# Altium project nrf52833_qiaa_var5.PrjPCB
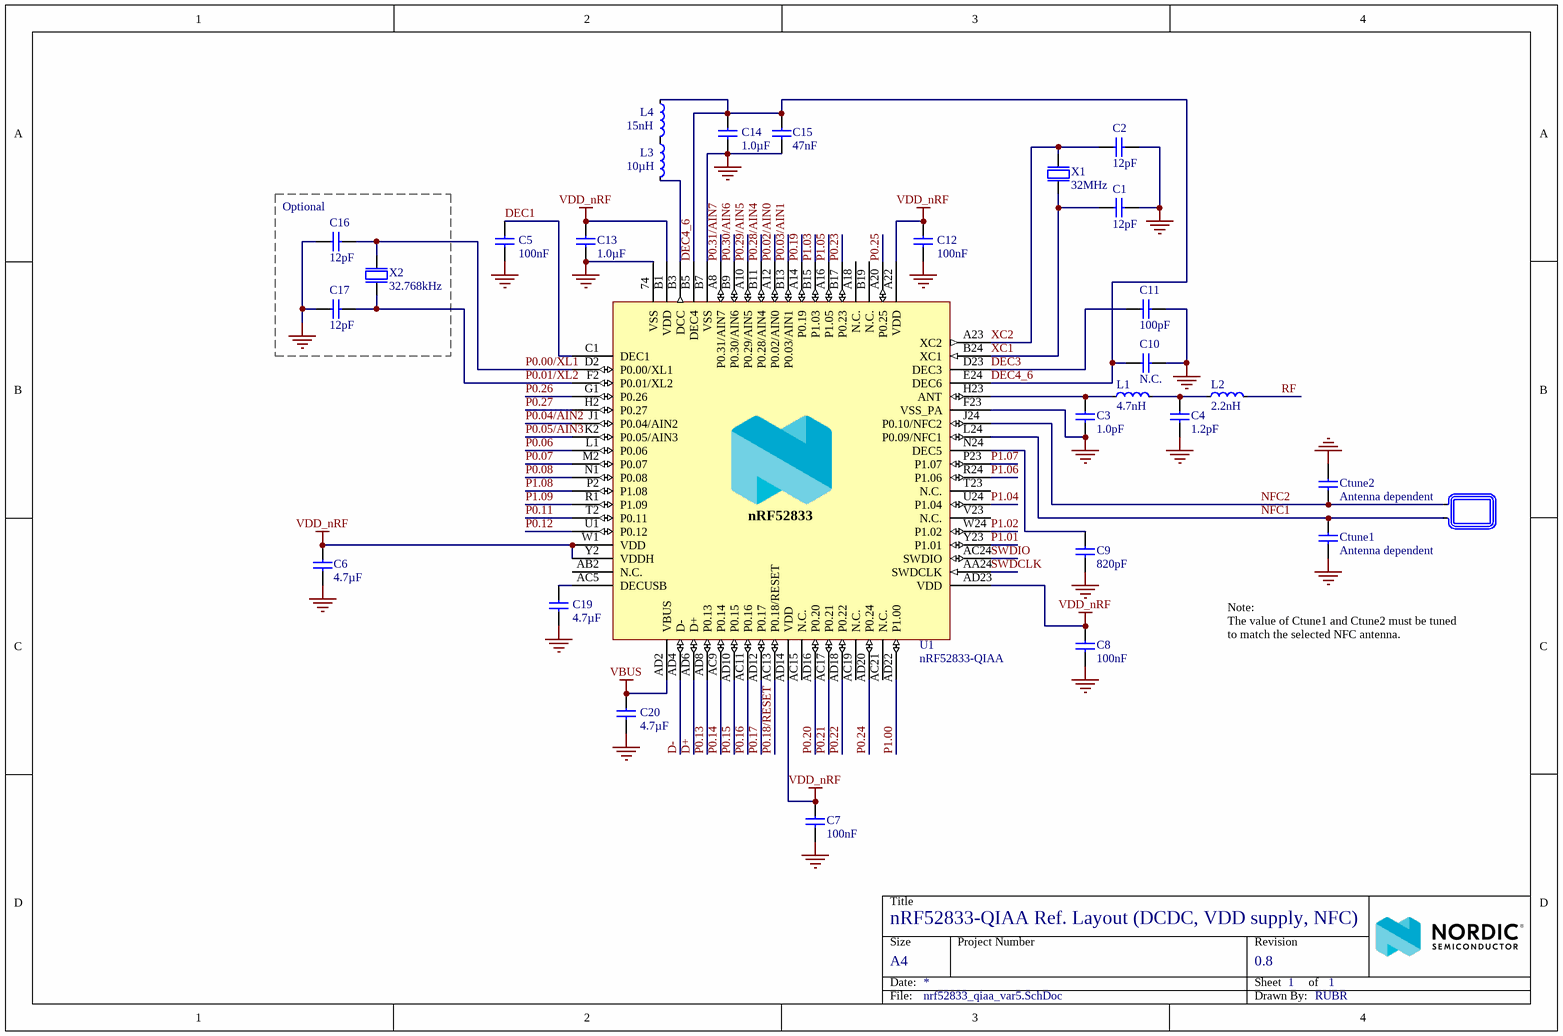
[diagram p0: nrf52833_qiaa_var5.SchDoc]
1 sheet, 29 parts. Net scope: global (net labels, ports and power ports of the same name join across sheets).
Board file: nrf52833_qiaa_var5.PcbDoc

## Sheet nrf52833_qiaa_var5.SchDoc: nRF52833-QIAA Ref. Layout (DCDC, VDD supply, NFC)
size A4; Revision: 0.8; SheetNumber: 1; SheetTotal: 1; DrawnBy: RUBR; DocumentSize: A4; PCAName: nRF52833-QIAA Ref. Layout (DCDC, VDD supply, NFC)

### Parts
A1  NFC Antenna  [TP_2x1mm_TH]  (value not drawn)  (no BOM)
C1  12pF  [CAPC1005X04L]
C2  12pF  [CAPC1005X04L]
C3  1.0pF  [CAPC1005X04L]
C4  1.2pF  [CAPC1005X04L]
C5  100nF  [CAPC1005X04L]
C6  4.7µF  [CAPC1608X06L]
C7  100nF  [CAPC1005X04L]
C8  100nF  [CAPC1005X04L]
C9  820pF  [CAPC1005X04L]
C10  N.C.  [CAPC1005X04L]
C11  100pF  [CAPC1005X04L]
C12  100nF  [CAPC1005X04L]
C13  1.0µF  [CAPC1608X06L]
C14  1.0µF  [CAPC1608X06L]
C15  47nF  [CAPC1005X04L]
C16  12pF  [CAPC1005X04L]
C17  12pF  [CAPC1005X04L]
C19  4.7µF  [CAPC1608X06L]
C20  4.7µF  [CAPC1608X06L]
Ctune1  Antenna dependent  [CAPC1005X04L]
Ctune2  Antenna dependent  [CAPC1005X04L]
L1  4.7nH  [INDC1005X04L]
L2  2.2nH  [INDC1005X04L]
L3  10µH  [INDC1608X06L]
L4  15nH  [INDC1005X04L]
U1  nRF52833-QIAA  [AQFN50P700X700X85_HS-74N]
X1  32MHz  [BT-XTAL_2016]
X2  32.768kHz  [XTAL_3215]

### Blocks framed on the sheet
Optional: C16 C17 X2

### Nets
GND: C1.2 C2.2 C3.1 C4.1 C5.2 C6.2 C7.2 C8.2 C9.2 C10.1 C11.2 C12.2 C13.2 C14.1 C15.2 C16.2 C17.2 C19.2 C20.2 Ctune1.2 Ctune2.1 U1.74(VSS) U1.B7(VSS) U1.F23(VSS_PA) X1.2(GND) X1.4(GND)
VBUS: C20.1 U1.AD2(VBUS)
VDD_nRF: C6.1 C7.1 C8.1 C12.1 C13.1 U1.A22(VDD) U1.AD14(VDD) U1.AD23(VDD) U1.B1(VDD) U1.W1(VDD) U1.Y2(VDDH)
D+: U1.AD6(D+)
D-: U1.AD4(D-)
DEC1: C5.1 U1.C1(DEC1)
DEC3: C11.1 U1.D23(DEC3)
DEC4_6: C10.2 C14.2 C15.1 L4.1 U1.B5(DEC4) U1.E24(DEC6)
NFC1: A1.2 Ctune1.1 U1.L24(P0.09/NFC1)
NFC2: A1.1 Ctune2.2 U1.J24(P0.10/NFC2)
P0.00/XL1: C16.1 U1.D2(P0.00/XL1) X2.1(inp)
P0.01/XL2: C17.1 U1.F2(P0.01/XL2) X2.2(out)
P0.02/AIN0: U1.A12(P0.02/AIN0)
P0.03/AIN1: U1.B13(P0.03/AIN1)
P0.04/AIN2: U1.J1(P0.04/AIN2)
P0.05/AIN3: U1.K2(P0.05/AIN3)
P0.06: U1.L1(P0.06)
P0.07: U1.M2(P0.07)
P0.08: U1.N1(P0.08)
P0.11: U1.T2(P0.11)
P0.12: U1.U1(P0.12)
P0.13: U1.AD8(P0.13)
P0.14: U1.AC9(P0.14)
P0.15: U1.AD10(P0.15)
P0.16: U1.AC11(P0.16)
P0.17: U1.AD12(P0.17)
P0.18/RESET: U1.AC13(P0.18/RESET)
P0.19: U1.A14(P0.19)
P0.20: U1.AD16(P0.20)
P0.21: U1.AC17(P0.21)
P0.22: U1.AD18(P0.22)
P0.23: U1.B17(P0.23)
P0.24: U1.AD20(P0.24)
P0.25: U1.A20(P0.25)
P0.26: U1.G1(P0.26)
P0.27: U1.H2(P0.27)
P0.28/AIN4: U1.B11(P0.28/AIN4)
P0.29/AIN5: U1.A10(P0.29/AIN5)
P0.30/AIN6: U1.B9(P0.30/AIN6)
P0.31/AIN7: U1.A8(P0.31/AIN7)
P1.00: U1.AD22(P1.00)
P1.01: U1.Y23(P1.01)
P1.02: U1.W24(P1.02)
P1.03: U1.B15(P1.03)
P1.04: U1.U24(P1.04)
P1.05: U1.A16(P1.05)
P1.06: U1.R24(P1.06)
P1.07: U1.P23(P1.07)
P1.08: U1.P2(P1.08)
P1.09: U1.R1(P1.09)
RF: L2.2
SWDCLK: U1.AA24(SWDCLK)
SWDIO: U1.AC24(SWDIO)
XC1: C1.1 U1.B24(XC1) X1.1(inp)
XC2: C2.1 U1.A23(XC2) X1.3(out)
NetC3_2: C3.2 L1.1 U1.H23(ANT)
NetC4_2: C4.2 L1.2 L2.1
NetC9_1: C9.1 U1.N24(DEC5)
NetC19_1: C19.1 U1.AC5(DECUSB)
NetL3_1: L3.1 L4.2
NetL3_2: L3.2 U1.B3(DCC)

Not connected (* = marked no-connect by the designer): U1 A18(N.C.) AB2(N.C.) AC15(N.C.) AC19(N.C.) AC21(N.C.) B19(N.C.) T23(N.C.) V23(N.C.)

### Notes on the sheet
- Note:
  The value of Ctune1 and Ctune2 must be tuned to match the selected NFC antenna.
- Title
- Size
- Date:
- A4
- Project Number
- Sheet         of
- Revision
- File:
- Drawn By:
- (in symbol nRF52833-QIAA) nRF52833

### Library data of the parts
A1 = NFC_ANT_TP: Part Number: NFC_ANT_TP; Footprint Doc: TP_2x1mm_TH; LatestRevisionDate: 2016-02-23; Pin Count: 2; Publisher: Nordic Semiconductor; Published: 2016-02-23; Value: NFC Antenna; Note: *
C1 C2 C16 C17 = C0402-12p: Capacitor, NP0, ±2%; Note: 50V; Part Number: C0402-12p; LatestRevisionDate: 2011-05-11; Pin Count: 2; Publisher: Nordic Semiconductor; Published: 2009-05-08; Value: 12pF; Footprint Doc: 0402
C3 = C0402-1.0p: Capacitor, NP0, ±5%; Note: 50V; Part Number: C0402-1.0p; LatestRevisionDate: 2017-02-23; Pin Count: 2; Publisher: Nordic Semiconductor; Published: 2009-05-08; Value: 1.0pF; Footprint Doc: 0402
C4 = C0402-1.2p: Capacitor, NP0, ±5%; Note: 50V; Part Number: C0402-1.2p; LatestRevisionDate: 2011-05-11; Pin Count: 2; Publisher: Nordic Semiconductor; Published: 2009-05-08; Value: 1.2pF; Footprint Doc: 0402
C5 C7 C8 C12 = C0402-100n: Capacitor, X7R, ±10%; Note: 16V; Part Number: C0402-100n; LatestRevisionDate: 2009-11-23; Pin Count: 2; Publisher: Nordic Semiconductor; Published: 2009-05-08; Value: 100nF; Footprint Doc: 0402
C6 C19 = C0603-4µ7-6.3V-X7R: Capacitor, X7R, ±10%; Note: 6.3V; Part Number: C0603-4µ7-6.3V-X7R; LatestRevisionDate: 2015-06-10; Pin Count: 2; Publisher: Nordic Semiconductor; Published: 2015-06-10; Value: 4.7µF; Footprint Doc: 0603
C9 = C0402-820p: Capacitor, NP0, ±5%; Note: 50V; Part Number: C0402-820p; LatestRevisionDate: 2009-05-08; Pin Count: 2; Publisher: Nordic Semiconductor; Published: 2009-05-08; Value: 820pF; Footprint Doc: 0402
C10 = C0402-N.C.: Not mounted; Assembly: Not mounted; Part Number: C0402-N.C.; LatestRevisionDate: 2009-05-08; Pin Count: 2; Publisher: Nordic Semiconductor; Published: 2009-05-08; Value: N.C.; Footprint Doc: 0402
C11 = C0402-100p: Capacitor, NP0, ±5%; Note: 50V; Part Number: C0402-100p; LatestRevisionDate: 2009-05-08; Pin Count: 2; Publisher: Nordic Semiconductor; Published: 2009-05-08; Value: 100pF; Footprint Doc: 0402
C13 C14 = C0603-1µ0: Capacitor, X7R, ±10%; Note: 16V; Part Number: C0603-1µ0; LatestRevisionDate: 2013-06-05; Pin Count: 2; Publisher: Nordic Semiconductor; Published: 2009-05-08; Value: 1.0µF; Footprint Doc: 0603
C15 = C0402-47n: Capacitor, X7R, ±10%; Note: Chip Cap 10%; Part Number: C0402-47n; LatestRevisionDate: 2009-05-08; Pin Count: 2; Publisher: Nordic Semiconductor; Published: 2009-05-08; Value: 47nF; Footprint Doc: 0402
C20 = C0603-4µ7-10V-X7S: Capacitor, X7S, ±10%; Note: 10V; Part Number: C0603-4µ7-10V-X7S; LatestRevisionDate: 2016-08-15; Pin Count: 2; Publisher: Nordic Semiconductor; Published: 2016-08-15; Value: 4.7µF; Footprint Doc: 0603
Ctune1 Ctune2 = C0402-TBD: Capacitor, NP0, ±5%; Note: 50V; Part Number: C0402-TBD; Footprint Doc: 0402; LatestRevisionDate: 2010-12-21; Pin Count: 2; Publisher: Nordic Semiconductor; Published: 2010-12-21; Value: Antenna dependent
L1 = L0402-4n7: High frequency chip inductor ±5%; Part Number: L0402-4n7; LatestRevisionDate: 2012-09-19; Pin Count: 2; Publisher: Nordic Semiconductor; Published: 2009-05-08; Value: 4.7nH; Note: High frequency chip inductor ±5%; Footprint Doc: 0402
L2 = L0402-2n2: High frequency chip inductor ±5%; Part Number: L0402-2n2; LatestRevisionDate: 2012-09-19; Pin Count: 2; Publisher: Nordic Semiconductor; Published: 2009-05-08; Value: 2.2nH; Note: High frequency chip inductor ±5%; Footprint Doc: 0402
L3 = L0603-10µ: Chip inductor, IDC,min = 50 mA, ±20%; Part Number: L0603-10µ; LatestRevisionDate: 2012-09-19; Pin Count: 2; Publisher: Nordic Semiconductor; Published: 2010-02-24; Value: 10µH; Footprint Doc: 0603
L4 = L0402-15n: High frequency chip inductor ±10%; Part Number: L0402-15n; LatestRevisionDate: 2012-09-19; Pin Count: 2; Publisher: Nordic Semiconductor; Published: 2010-07-12; Value: 15nH; Footprint Doc: 0402
U1 = nRF52833-QIAA: Multi-protocol Bluetooth Low Energy, IEEE 802.15.4, ANT and 2.4GHz proprietary system-on-chip; Manufacturer: Nordic Semiconductor; Part Number: nRF52833-QIAA; LatestRevisionDate: 2018-12-03; Pin Count: 73; Publisher: Nordic Semiconductor; Published: 2018-12-03; Value: nRF52833-QIAA; Note: *; Footprint Doc: AQFN-73; Manufacturer Part Number: nRF52833-QIAA
X1 = XTAL_SMD2016_32MHz_8pF_General: XTAL SMD 2016, 32MHz, Cl=8pF, Total Tol: ±40ppm; Part Number: XTAL_SMD2016_32MHz_8pF_General; LatestRevisionDate: 2016-08-19; Pin Count: 4; Publisher: Nordic Semiconductor; Published: 2016-08-19; Value: 32MHz; Footprint Doc: XTAL_2016
X2 = XTAL_SMD3215_32.768kHz_9pF_General: XTAL SMD 3215, 32.768kHz, Cl=9pF, Total Tol: ±50ppm; Part Number: XTAL_SMD3215_32.768kHz_9pF_General; LatestRevisionDate: 2016-08-19; Pin Count: 2; Publisher: Nordic Semiconductor; Published: 2016-08-19; Value: 32.768kHz; Footprint Doc: XTAL_3215